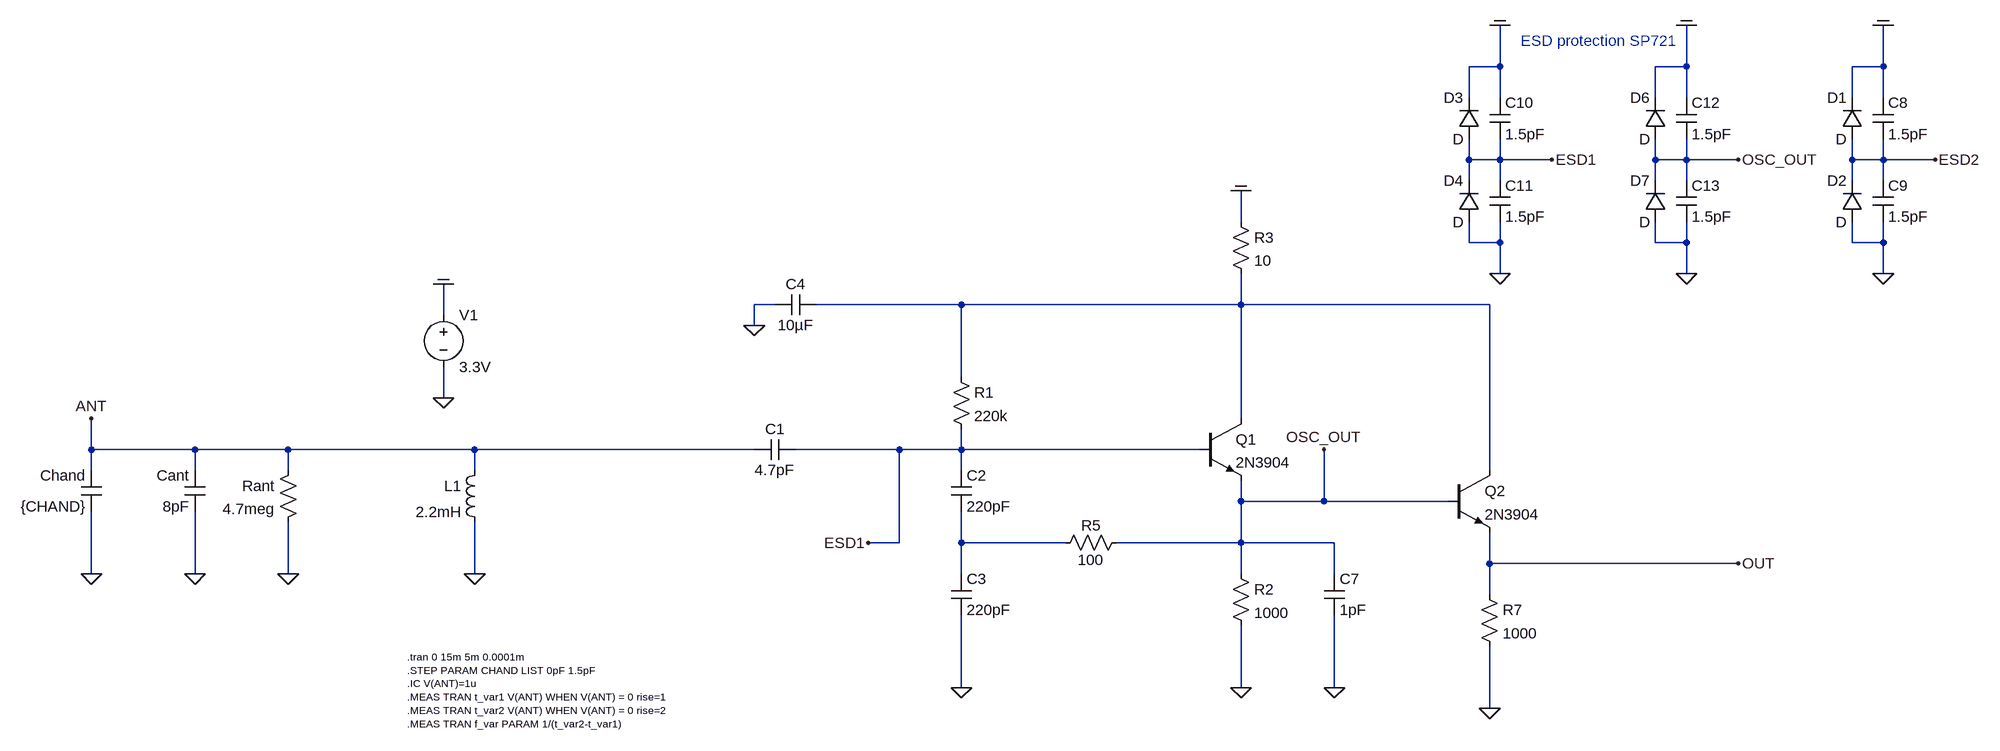
[diagram p0: schematic 2020_analog_oscill_sin_33v_v03.asc]
2020_analog_oscill_sin_33v_v03.asc, the LTspice schematic file:
Version 4
SHEET 1 2908 1508
WIRE 1104 -400 1104 -464
WIRE 1104 -400 1056 -400
WIRE 1392 -400 1392 -464
WIRE 1392 -400 1344 -400
WIRE 1696 -400 1696 -464
WIRE 1696 -400 1648 -400
WIRE 1056 -352 1056 -400
WIRE 1104 -352 1104 -400
WIRE 1344 -352 1344 -400
WIRE 1392 -352 1392 -400
WIRE 1648 -352 1648 -400
WIRE 1696 -352 1696 -400
WIRE 1056 -256 1056 -288
WIRE 1104 -256 1104 -288
WIRE 1104 -256 1056 -256
WIRE 1184 -256 1104 -256
WIRE 1344 -256 1344 -288
WIRE 1392 -256 1392 -288
WIRE 1392 -256 1344 -256
WIRE 1472 -256 1392 -256
WIRE 1648 -256 1648 -288
WIRE 1696 -256 1696 -288
WIRE 1696 -256 1648 -256
WIRE 1776 -256 1696 -256
WIRE 1056 -224 1056 -256
WIRE 1104 -224 1104 -256
WIRE 1344 -224 1344 -256
WIRE 1392 -224 1392 -256
WIRE 1648 -224 1648 -256
WIRE 1696 -224 1696 -256
WIRE 704 -160 704 -208
WIRE 1056 -128 1056 -160
WIRE 1104 -128 1104 -160
WIRE 1104 -128 1056 -128
WIRE 1344 -128 1344 -160
WIRE 1392 -128 1392 -160
WIRE 1392 -128 1344 -128
WIRE 1648 -128 1648 -160
WIRE 1696 -128 1696 -160
WIRE 1696 -128 1648 -128
WIRE 1104 -80 1104 -128
WIRE 1392 -80 1392 -128
WIRE 1696 -80 1696 -128
WIRE -16 -32 -48 -32
WIRE 272 -32 48 -32
WIRE 704 -32 704 -80
WIRE 704 -32 272 -32
WIRE 1088 -32 704 -32
WIRE -528 -16 -528 -64
WIRE -48 0 -48 -32
WIRE 272 80 272 -32
WIRE -528 112 -528 64
WIRE 704 144 704 -32
WIRE -1072 192 -1072 144
WIRE -912 192 -1072 192
WIRE -768 192 -912 192
WIRE -480 192 -768 192
WIRE -48 192 -480 192
WIRE 176 192 16 192
WIRE 272 192 272 160
WIRE 272 192 176 192
WIRE 640 192 272 192
WIRE -1072 224 -1072 192
WIRE -912 224 -912 192
WIRE -768 224 -768 192
WIRE -480 224 -480 192
WIRE 272 224 272 192
WIRE 1088 224 1088 -32
WIRE 704 272 704 240
WIRE 832 272 832 192
WIRE 832 272 704 272
WIRE 1024 272 832 272
WIRE 176 336 176 192
WIRE 176 336 128 336
WIRE 272 336 272 288
WIRE 432 336 272 336
WIRE 704 336 704 272
WIRE 704 336 512 336
WIRE 848 336 704 336
WIRE 1088 368 1088 320
WIRE 1472 368 1088 368
WIRE -1072 384 -1072 288
WIRE -912 384 -912 288
WIRE -768 384 -768 304
WIRE -480 384 -480 304
WIRE 272 384 272 336
WIRE 704 384 704 336
WIRE 848 384 848 336
WIRE 1088 416 1088 368
WIRE 272 560 272 448
WIRE 704 560 704 464
WIRE 848 560 848 448
WIRE 1088 592 1088 496
FLAG -528 112 0
FLAG -1072 384 0
FLAG -1072 144 ANT
FLAG -480 384 0
FLAG 272 560 0
FLAG 704 560 0
FLAG -768 384 0
FLAG -48 0 0
FLAG 832 192 OSC_OUT
FLAG -528 -64 COM
FLAG 704 -208 COM
FLAG 1104 -80 0
FLAG 1104 -464 COM
FLAG 1184 -256 ESD1
FLAG 1392 -80 0
FLAG 1392 -464 COM
FLAG 1472 -256 OSC_OUT
FLAG 128 336 ESD1
FLAG 1472 368 OUT
FLAG 1088 592 0
FLAG 1696 -80 0
FLAG 1696 -464 COM
FLAG 1776 -256 ESD2
FLAG -912 384 0
FLAG 848 560 0
SYMBOL cap 256 224 R0
SYMATTR InstName C2
SYMATTR Value 220pF
SYMBOL res 256 64 R0
SYMATTR InstName R1
SYMATTR Value 220k
SYMBOL voltage -528 -32 R0
WINDOW 123 0 0 Left 2
WINDOW 39 0 0 Left 2
SYMATTR InstName V1
SYMATTR Value 3.3V
SYMBOL ind -464 208 M0
SYMATTR InstName L1
SYMATTR Value 2.2mH
SYMATTR SpiceLine Ipk=0.1 Rser=72 Rpar=1.9Meg Cpar=1.147pF
SYMBOL cap -1056 224 M0
SYMATTR InstName Chand
SYMATTR Value {CHAND}
SYMBOL cap -48 176 M90
WINDOW 0 0 32 VBottom 2
WINDOW 3 32 32 VTop 2
SYMATTR InstName C1
SYMATTR Value 4.7pF
SYMBOL npn 640 144 R0
SYMATTR InstName Q1
SYMATTR Value 2N3904
SYMBOL cap 256 384 R0
SYMATTR InstName C3
SYMATTR Value 220pF
SYMBOL res 688 368 R0
SYMATTR InstName R2
SYMATTR Value 1000
SYMBOL res -752 208 M0
SYMATTR InstName Rant
SYMATTR Value 4.7meg
SYMBOL cap 48 -48 R90
WINDOW 0 0 32 VBottom 2
WINDOW 3 32 32 VTop 2
SYMATTR InstName C4
SYMATTR Value 10µF
SYMBOL res 688 -176 R0
SYMATTR InstName R3
SYMATTR Value 10
SYMBOL res 528 320 R90
WINDOW 0 5 56 VBottom 2
WINDOW 3 27 56 VTop 2
SYMATTR InstName R5
SYMATTR Value 100
SYMBOL diode 1072 -288 R180
WINDOW 0 24 64 Left 2
WINDOW 3 24 0 Left 2
SYMATTR InstName D3
SYMBOL diode 1072 -160 R180
WINDOW 0 24 64 Left 2
WINDOW 3 24 0 Left 2
SYMATTR InstName D4
SYMBOL cap 1088 -352 R0
SYMATTR InstName C10
SYMATTR Value 1.5pF
SYMBOL cap 1088 -224 R0
SYMATTR InstName C11
SYMATTR Value 1.5pF
SYMBOL diode 1360 -288 R180
WINDOW 0 24 64 Left 2
WINDOW 3 24 0 Left 2
SYMATTR InstName D6
SYMBOL diode 1360 -160 R180
WINDOW 0 24 64 Left 2
WINDOW 3 24 0 Left 2
SYMATTR InstName D7
SYMBOL cap 1376 -352 R0
SYMATTR InstName C12
SYMATTR Value 1.5pF
SYMBOL cap 1376 -224 R0
SYMATTR InstName C13
SYMATTR Value 1.5pF
SYMBOL npn 1024 224 R0
SYMATTR InstName Q2
SYMATTR Value 2N3904
SYMBOL res 1072 400 R0
SYMATTR InstName R7
SYMATTR Value 1000
SYMBOL diode 1664 -288 R180
WINDOW 0 24 64 Left 2
WINDOW 3 24 0 Left 2
SYMATTR InstName D1
SYMBOL diode 1664 -160 R180
WINDOW 0 24 64 Left 2
WINDOW 3 24 0 Left 2
SYMATTR InstName D2
SYMBOL cap 1680 -352 R0
SYMATTR InstName C8
SYMATTR Value 1.5pF
SYMBOL cap 1680 -224 R0
SYMATTR InstName C9
SYMATTR Value 1.5pF
SYMBOL cap -896 224 M0
SYMATTR InstName Cant
SYMATTR Value 8pF
SYMBOL cap 832 384 R0
SYMATTR InstName C7
SYMATTR Value 1pF
TEXT -584 512 Left 1 !.tran 0 15m 5m 0.0001m\n.STEP PARAM CHAND LIST 0pF 1.5pF\n.IC V(ANT)=1u\n.MEAS TRAN t_var1 V(ANT) WHEN V(ANT) = 0 rise=1\n.MEAS TRAN t_var2 V(ANT) WHEN V(ANT) = 0 rise=2\n.MEAS TRAN f_var PARAM 1/(t_var2-t_var1)
TEXT 1136 -440 Left 2 ;ESD protection SP721

The netlist it stands for:
* 2020_analog_oscill_sin_33v_v03.asc
C2 ESD1 N002 220pF
R1 N001 ESD1 220k
V1 COM 0 3.3V
L1 ANT 0 2.2mH Ipk=0.1 Rser=72 Rpar=1.9Meg Cpar=1.147pF
Chand ANT 0 {CHAND}
C1 ANT ESD1 4.7pF
Q1 N001 ESD1 OSC_OUT 0 2N3904
C3 N002 0 220pF
R2 OSC_OUT 0 1000
Rant ANT 0 4.7meg
C4 N001 0 10µF
R3 COM N001 10
R5 OSC_OUT N002 100
D3 ESD1 COM D
D4 0 ESD1 D
C10 COM ESD1 1.5pF
C11 ESD1 0 1.5pF
D6 OSC_OUT COM D
D7 0 OSC_OUT D
C12 COM OSC_OUT 1.5pF
C13 OSC_OUT 0 1.5pF
Q2 N001 OSC_OUT OUT 0 2N3904
R7 OUT 0 1000
D1 ESD2 COM D
D2 0 ESD2 D
C8 COM ESD2 1.5pF
C9 ESD2 0 1.5pF
Cant ANT 0 8pF
C7 OSC_OUT 0 1pF
.model D D
.lib standard.dio
.model NPN NPN
.model PNP PNP
.lib standard.bjt
.tran 0 15m 5m 0.0001m
.STEP PARAM CHAND LIST 0pF 1.5pF
.IC V(ANT)=1u
.MEAS TRAN t_var1 V(ANT) WHEN V(ANT) = 0 rise=1
.MEAS TRAN t_var2 V(ANT) WHEN V(ANT) = 0 rise=2
.MEAS TRAN f_var PARAM 1/(t_var2-t_var1)
* ESD protection SP721
.backanno
.end